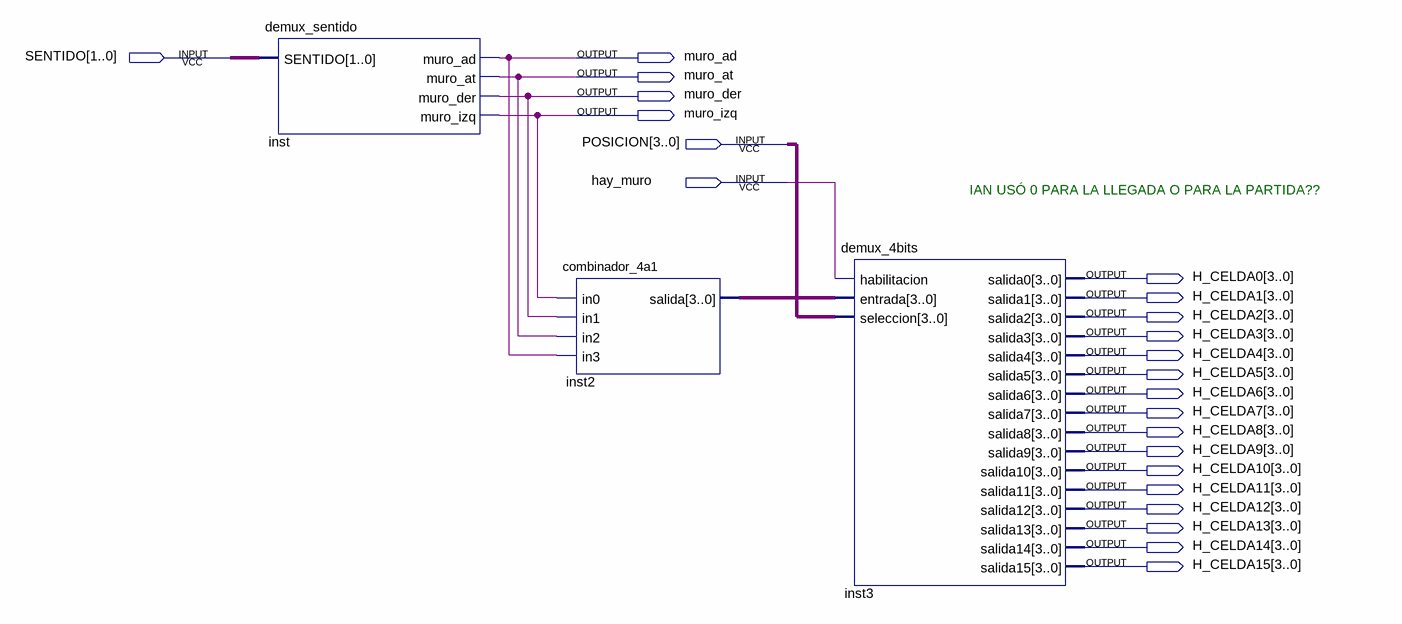
[diagram p0: schematic sheet]
// Quartus schematic escribe_muros.bdf as structural Verilog: 3 symbols, 23 pins
module escribe_muros (
  input  [1:0] SENTIDO,
  input  [3:0] POSICION,
  input  hay_muro,
  output muro_ad,
  output muro_at,
  output muro_der,
  output muro_izq,
  output [3:0] H_CELDA0,
  output [3:0] H_CELDA1,
  output [3:0] H_CELDA2,
  output [3:0] H_CELDA3,
  output [3:0] H_CELDA4,
  output [3:0] H_CELDA5,
  output [3:0] H_CELDA6,
  output [3:0] H_CELDA7,
  output [3:0] H_CELDA8,
  output [3:0] H_CELDA9,
  output [3:0] H_CELDA10,
  output [3:0] H_CELDA11,
  output [3:0] H_CELDA12,
  output [3:0] H_CELDA13,
  output [3:0] H_CELDA14,
  output [3:0] H_CELDA15
);

  wire [3:0] inst2_salida;

  demux_sentido inst (
    .SENTIDO(SENTIDO), .muro_ad(muro_ad), .muro_at(muro_at), .muro_der(muro_der), .muro_izq(muro_izq));
  combinador_4a1 inst2 (.in0(muro_izq), .in1(muro_der), .in2(muro_at), .in3(muro_ad), .salida(inst2_salida));
  demux_4bits inst3 (
    .habilitacion(hay_muro), .entrada(inst2_salida), .seleccion(POSICION), .salida0(H_CELDA0),
    .salida1(H_CELDA1), .salida2(H_CELDA2), .salida3(H_CELDA3), .salida4(H_CELDA4), .salida5(H_CELDA5),
    .salida6(H_CELDA6), .salida7(H_CELDA7), .salida8(H_CELDA8), .salida9(H_CELDA9), .salida10(H_CELDA10),
    .salida11(H_CELDA11), .salida12(H_CELDA12), .salida13(H_CELDA13), .salida14(H_CELDA14),
    .salida15(H_CELDA15));

  // Notes on the sheet:
  //   IAN USÓ 0 PARA LA LLEGADA O PARA LA PARTIDA??       
endmodule
